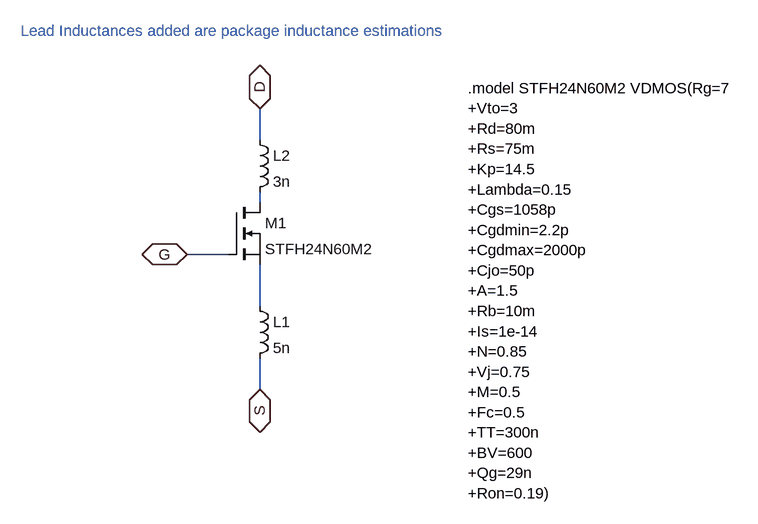
[diagram p0: schematic STFH24N60M2.asc]
STFH24N60M2.asc, the LTspice schematic file:
Version 4.1
SHEET 1 2968 980
WIRE -256 -144 -256 -192
WIRE -256 -48 -256 -64
WIRE -304 32 -368 32
WIRE -256 112 -256 48
WIRE -256 240 -256 192
FLAG -256 -192 D
IOPIN -256 -192 BiDir
FLAG -368 32 G
IOPIN -368 32 BiDir
FLAG -256 240 S
IOPIN -256 240 BiDir
SYMBOL nmos -304 -48 R0
SYMATTR InstName M1
SYMATTR Value STFH24N60M2
SYMBOL ind -272 96 R0
SYMATTR InstName L1
SYMATTR Value 5n
SYMATTR SpiceLine Cpar=10p
SYMBOL ind -272 -160 R0
SYMATTR InstName L2
SYMATTR Value 3n
SYMATTR SpiceLine Cpar=10p
TEXT -624 -312 Left 2 ;Lead Inductances added are package inductance estimations
TEXT 64 -224 Left 2 !.model STFH24N60M2 VDMOS(Rg=7 \n+Vto=3\n+Rd=80m\n+Rs=75m\n+Kp=14.5\n+Lambda=0.15\n+Cgs=1058p\n+Cgdmin=2.2p\n+Cgdmax=2000p\n+Cjo=50p\n+A=1.5\n+Rb=10m\n+Is=1e-14\n+N=0.85\n+Vj=0.75\n+M=0.5\n+Fc=0.5\n+TT=300n\n+BV=600\n+Qg=29n\n+Ron=0.19)

The netlist it stands for:
* STFH24N60M2.asc
M1 N001 G N002 N002 STFH24N60M2
L1 N002 S 5n Cpar=10p
L2 D N001 3n Cpar=10p
.model NMOS NMOS
.model PMOS PMOS
.lib standard.mos
* Lead Inductances added are package inductance estimations
.model STFH24N60M2 VDMOS(Rg=7
+Vto=3
+Rd=80m
+Rs=75m
+Kp=14.5
+Lambda=0.15
+Cgs=1058p
+Cgdmin=2.2p
+Cgdmax=2000p
+Cjo=50p
+A=1.5
+Rb=10m
+Is=1e-14
+N=0.85
+Vj=0.75
+M=0.5
+Fc=0.5
+TT=300n
+BV=600
+Qg=29n
+Ron=0.19)
.backanno
.end